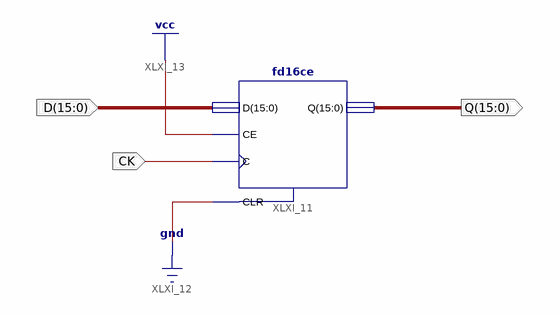
[diagram p0: schematic sheet 1]
// Xilinx ISE schematic f1d16.sch (Spartan2E) as structural Verilog: 1 symbols, 3 ports
module f1d16 (
  input  [15:0] D,
  input  CK,
  output [15:0] Q
);

  fd16ce XLXI_11 (.C(CK), .CE(1'b1), .CLR(1'b0), .D(D), .Q(Q));
endmodule
